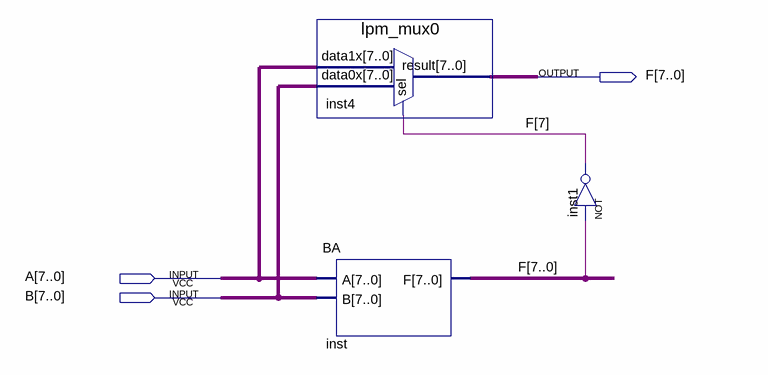
[diagram p0: schematic sheet]
// Quartus schematic MAX.bdf as structural Verilog: 3 symbols, 3 pins
module MAX (
  input  [7:0] A,
  input  [7:0] B,
  output [7:0] F
);

  wire undriven;

  lpm_mux0 inst4 (.data1x(A), .data0x(B), .sel(F[7]), .result(F));
  BA inst (.A(A), .B(B), .F(F));
  not inst1 (F[7], undriven);
endmodule
